# Altium schematic sheet QVAR.SchDoc: QVAR sensor
size A4; Organization: ETHZ D-ITET PBL, IIS; DocumentNumber: 3; SheetNumber: 3; SheetTotal: 3; FileInfo: QVAR.SchDoc
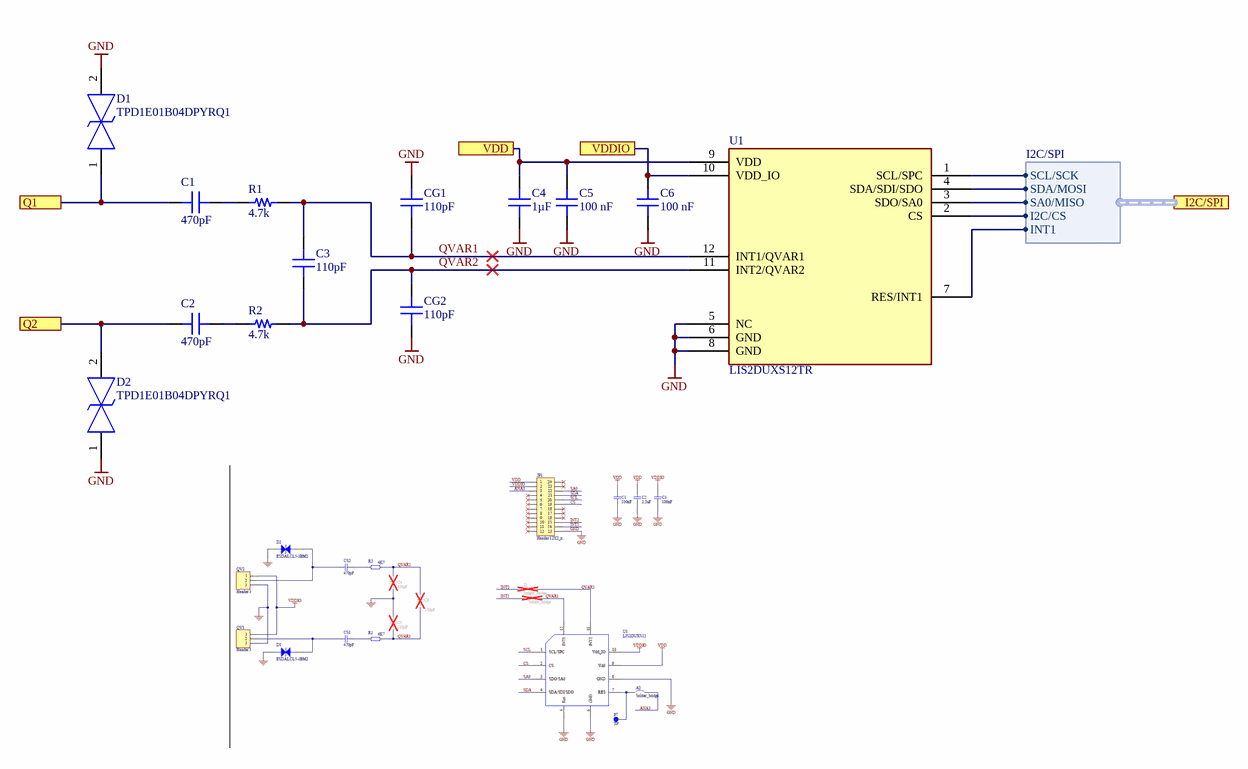
[diagram p0: QVAR.SchDoc]

## Parts
C1  470pF  [CAP_0201]
C2  470pF  [CAP_0201]
C3  110pF  [CAP_0201]
C4  1µF  [CAP_0201]
C5  100 nF  [CAP_0201]
C6  100 nF  [CAP_0201]
CG1  110pF  [CAP_0201]
CG2  110pF  [CAP_0201]
D1  TPD1E01B04DPYRQ1  [TPD1E01B04DPYRQ1]
D2  TPD1E01B04DPYRQ1  [TPD1E01B04DPYRQ1]
R1  4.7k  [RES_0201]
R2  4.7k  [RES_0201]
U1  LIS2DUXS12TR  [QFN_DUXS12_STM-M]

## Ports
I2C/SPI (harness I2C/SPI), Q1, Q2, VDD, VDDIO

## Harnesses
I2C/SPI: SCL/SCK, SDA/MOSI, SA0/MISO, I2C/CS, INT1

## Nets
GND: C4.2 C5.1 C6.1 CG1.1 CG2.1 D1.2 D2.1 U1.5(NC) U1.6(GND) U1.8(GND)
Q1: C1.1 D1.1 ; port Q1
Q2: C2.1 D2.2 ; port Q2
QVAR1: C3.1 CG1.2 R1.2 U1.12(INT1/QVAR1)
QVAR2: C3.2 CG2.2 R2.2 U1.11(INT2/QVAR2)
VDD: C4.1 C5.2 U1.9(VDD) ; port VDD
VDDIO: C6.2 U1.10(VDD_IO) ; port VDDIO
NetC1_2: C1.2 R1.1
NetC2_2: C2.2 R2.1
NetU1_1: U1.1(SCL/SPC) ; port I2C/SPI.SCL/SCK
NetU1_2: U1.2(CS) ; port I2C/SPI.I2C/CS
NetU1_3: U1.3(SDO/SA0) ; port I2C/SPI.SA0/MISO
NetU1_4: U1.4(SDA/SDI/SDO) ; port I2C/SPI.SDA/MOSI
NetU1_7: U1.7(RES/INT1) ; port I2C/SPI.INT1

## Notes on the sheet
- Project:
- Laboratory:
- Date:
- File:
- Rev:
- Variation:
- Drawn By:
- Checked By:
- Sheet:
- /

## Library data of the parts
C1 C2 = CAP_0201_470p_25V: CAP CER 470PF 25V C0G 0201; Manufacturer: Murata; Manufacturer Part Number: GRM0335C1E471JA01D; Capacitor Type: Ceramic; Multilayer: Yes; Tolerance  (fill in as +-): 5%; Supplier 1: Mouser; RoHS: Yes; Category: Ceramic Capacitors; Stock 1: 32770; Pricing 1: 1=0.1, 10=0.007, 50=0.007, 100=0.004, 1000=0.003, 10000=0.003 (USD); Mounting Technology: Surface Mount; Pins: 2; Package Shape: Rectangular; Case/Package: 0201; Terminal Finish: Tin; Min Operating Temperature: -55°C; Max Operating Temperature: 125°C; JESD-609 Code: e3; Value: 470pF; Packaging: Tape and Reel; Rated DC Voltage (URdc): 25V; Temperature Characteristics Code: C0G; Termination: Wraparound; Reach SVHC Compliant: Yes; RoHS Compliant: Yes; ComponentLink1URL: https://psearch.en.murata.com:443/capacitor/product/GRM0335C1E471JA01%23.pdf?src-supplier=IHS+Markit; ComponentLink1Description: https://psearch.en.murata.com:443/capacitor/product/GRM0335C1E471JA01%23.pdf?src-supplier=IHS+Markit; Supplier Part Number 1: 81-GRM0335C1E471JA1D; ComponentLink2Description: http://search.murata.co.jp/Ceramy/image/img/A01X/G101/ENG/GRM0335C1E471JA01-01.pdf?src-supplier=Digi-Key; ComponentLink2URL: http://search.murata.co.jp/Ceramy/image/img/A01X/G101/ENG/GRM0335C1E471JA01-01.pdf?src-supplier=Digi-Key; ComponentLink3Description: https://search.murata.co.jp/Ceramy/image/img/A01X/G101/ENG/GRM0335C1E471JA01-01.pdf?src-supplier=Digi-Key; ComponentLink3URL: https://search.murata.co.jp/Ceramy/image/img/A01X/G101/ENG/GRM0335C1E471JA01-01.pdf?src-supplier=Digi-Key; ComponentLink4Description: https://datasheet.octopart.com/GRM0335C1E471JA01D-Murata-datasheet-165579666.pdf?src-supplier=TME; ComponentLink4URL: https://datasheet.octopart.com/GRM0335C1E471JA01D-Murata-datasheet-165579666.pdf?src-supplier=TME; Dielectric Material: Ceramic; Tolerance (fill in as +-): 5%
C3 CG1 CG2 = CAP_0201_110p_50V: CAP CER 110PF 50V C0G 0201; Manufacturer: Murata; Manufacturer Part Number: GRM0335C1H111JA01D; Capacitor Type: Ceramic; Multilayer: Yes; Tolerance  (fill in as +-): 5%; Supplier 1: Mouser; Supplier Part Number 1: 81-GRM0335C1H111JA1D; Case/Package: 0201; Category: Ceramic Capacitors; ComponentLink1Description: https://psearch.en.murata.com:443/capacitor/product/GRM0335C1H111JA01%23.pdf?src-supplier=IHS+Markit; ComponentLink1URL: https://psearch.en.murata.com:443/capacitor/product/GRM0335C1H111JA01%23.pdf?src-supplier=IHS+Markit; ComponentLink2Description: https://datasheet.ciiva.com/18699/grm0335c1h111ja01-01-18699253.pdf?src-supplier=Digi-Key; ComponentLink2URL: https://datasheet.ciiva.com/18699/grm0335c1h111ja01-01-18699253.pdf?src-supplier=Digi-Key; ComponentLink3Description: https://datasheet.ciiva.com/18699/partnumbering-e-01-18699254.pdf?src-supplier=Digi-Key; ComponentLink3URL: https://datasheet.ciiva.com/18699/partnumbering-e-01-18699254.pdf?src-supplier=Digi-Key; ComponentLink4Description: https://datasheet.ciiva.com/18699/partnumbering-e-01-18699255.pdf?src-supplier=Digi-Key; ComponentLink4URL: https://datasheet.ciiva.com/18699/partnumbering-e-01-18699255.pdf?src-supplier=Digi-Key; Dielectric Material: Ceramic; Max Operating Temperature: 125°C; Min Operating Temperature: -55°C; Mounting Technology: Surface Mount; Package Shape: Rectangular; Packaging: Tape and Reel; Pins: 2; Pricing 1: 1=0.1, 10=0.006, 50=0.006, 100=0.004, 1000=0.003, 10000=0.002 (USD); Rated DC Voltage (URdc): 50V; Reach SVHC Compliant: Yes; RoHS: Yes; RoHS Compliant: Yes; Stock 1: 26582; Temperature Characteristics Code: C0G; Termination: Wraparound; Tolerance (fill in as +-): 5%; Value: 110pF
C4 = CAP_0201_1u_10V: CAP CER 1UF 10V X6S; Manufacturer: Murata; Manufacturer Part Number: GRM033C81A105ME05D; Capacitor Type: Ceramic; Multilayer: Yes; Tolerance  (fill in as +-): 20%; Supplier 1: Mouser; Supplier Part Number 1: 81-GRM033C81A105ME5D; Case/Package: 0201; Category: Ceramic Capacitors; ComponentLink1Description: https://psearch.en.murata.com:443/capacitor/product/GRM033C81A105ME05%23.pdf?src-supplier=IHS+Markit; ComponentLink1URL: https://psearch.en.murata.com:443/capacitor/product/GRM033C81A105ME05%23.pdf?src-supplier=IHS+Markit; ComponentLink2Description: http://search.murata.co.jp/Ceramy/image/img/A01X/G101/ENG/GRM033C81A105ME05-01.pdf?src-supplier=Digi-Key; ComponentLink2URL: http://search.murata.co.jp/Ceramy/image/img/A01X/G101/ENG/GRM033C81A105ME05-01.pdf?src-supplier=Digi-Key; ComponentLink3Description: https://datasheet.octopart.com/GRM033C81A105ME05D-Murata-datasheet-86813717.pdf?src-supplier=Future+Electronics; ComponentLink3URL: https://datasheet.octopart.com/GRM033C81A105ME05D-Murata-datasheet-86813717.pdf?src-supplier=Future+Electronics; ComponentLink4Description: https://datasheet.octopart.com/GRM033C81A105ME05D-Murata-datasheet-165579666.pdf?src-supplier=TME; ComponentLink4URL: https://datasheet.octopart.com/GRM033C81A105ME05D-Murata-datasheet-165579666.pdf?src-supplier=TME; Dielectric Material: Ceramic; JESD-609 Code: e3; Max Operating Temperature: 105°C; Min Operating Temperature: -55°C; Mounting Technology: Surface Mount; Package Shape: Rectangular; Packaging: Tape and Reel; Pins: 2; Pricing 1: 1=0.3, 10=0.147, 50=0.147, 100=0.095, 1000=0.079, 10000=0.066 (USD); Rated DC Voltage (URdc): 10V; Reach SVHC Compliant: Yes; RoHS: Yes; RoHS Compliant: Yes; Stock 1: 212716; Temperature Characteristics Code: X6S; Terminal Finish: Nickel; Termination: Wraparound; Tolerance (fill in as +-): 20%; Value: 1uF
C5 C6 = CAP_0201_100n_10V: CAP CER 0.1UF 25V X5R 0201; Manufacturer: Murata; Manufacturer Part Number: GRM033R6YA104ME14D; Capacitor Type: Ceramic; Multilayer: Yes; Rated DC Voltage (URdc): 35V; Tolerance  (fill in as +-): 20%; Value: 100nF; Supplier 1: Mouser; Supplier Part Number 1: 81-GRM33R6YA104ME14D; Case/Package: 0201; Category: Ceramic Capacitors; ComponentLink1Description: https://psearch.en.murata.com:443/capacitor/product/GRM033R6YA104ME14%23.pdf?src-supplier=IHS+Markit; ComponentLink1URL: https://psearch.en.murata.com:443/capacitor/product/GRM033R6YA104ME14%23.pdf?src-supplier=IHS+Markit; ComponentLink2Description: http://www.mouser.com/ds/2/281/c02e-2905.pdf?src-supplier=Mouser; ComponentLink2URL: http://www.mouser.com/ds/2/281/c02e-2905.pdf?src-supplier=Mouser; ComponentLink3Description: http://search.murata.co.jp/Ceramy/image/img/A01X/G101/ENG/GRM033R6YA104ME14-01.pdf?src-supplier=Digi-Key; ComponentLink3URL: http://search.murata.co.jp/Ceramy/image/img/A01X/G101/ENG/GRM033R6YA104ME14-01.pdf?src-supplier=Digi-Key; ComponentLink4Description: https://datasheet.octopart.com/GRM033R6YA104ME14D-Murata-datasheet-82944622.pdf?src-supplier=Future+Electronics; ComponentLink4URL: https://datasheet.octopart.com/GRM033R6YA104ME14D-Murata-datasheet-82944622.pdf?src-supplier=Future+Electronics; Dielectric Material: Ceramic; Height: 0.3mm; JESD-609 Code: e3; Length: 0.6mm; Max Operating Temperature: 85°C; Min Operating Temperature: -55°C; Mounting Technology: Surface Mount; Package Shape: Rectangular; Package Style: SMTMeter; Packaging: Tape and Reel; Pins: 2; Pricing 1: 1=0.1, 10=0.013, 50=0.013, 100=0.008, 1000=0.006, 10000=0.005 (USD); Reach SVHC Compliant: Yes; RoHS: Yes; RoHS Compliant: Yes; Stock 1: 286132; Temperature Characteristics Code: X5R; Terminal Finish: Nickel; Termination: Wraparound; Tolerance (fill in as +-): 20%; Width: 0.3mm
D1 D2 = TPD1E01B04DPYRQ1: TVS Diode (Bi-directional); Manufacturer: Texas Instruments; Manufacturer Part Number: TPD1E01B04DPYRQ1; Category: Integrated Circuits (ICs); Pricing 1: 1=0.48, 10=0.358, 50=0.358, 100=0.229, 1000=0.143, 10000=0.114 (USD); RoHS: No; Stock 1: 7769; Supplier 1: Mouser; Supplier Part Number 1: 595-TPD1E01B04DPYRQ1
R1 R2 = R_0201_4.7K: R 4.7K 1% 50mW 0201; Manufacturer: Panasonic; Manufacturer Part Number: ERJ-1GNF4701C; Rated Temperature: 70°C; Temperature Coefficient: 200ppm/°C; Working Voltage: 25V; Package Height: 0.23mm; Package Length: 0.6mm; Package Width: 0.3mm; Reference Standard: AEC-Q200; Supplier 1: Mouser; RoHS: Yes; Category: Chip SMD Resistors; Stock 1: 339994; Pricing 1: 1=0.1, 10=0.023, 50=0.023, 100=0.014, 1000=0.01, 10000=0.007 (USD); Mounting Technology: Surface Mount; Pins: 2; Package Shape: Rectangular; Case/Package: 0201; Terminal Finish: Nickel; Min Operating Temperature: -55°C; Max Operating Temperature: 125°C; Tolerance: 1%; JESD-609 Code: e3; Resistor Type: FIXED RESISTOR; Construction: Rectangular; Package Style: SMTMeter; Packaging: Tape and Reel; Power: 50mW; Value: 4.7k; Technology: METAL GLAZE/THICK FILM; Termination: Wraparound; Reach SVHC Compliant: Yes; RoHS Compliant: Yes; ComponentLink1URL: https://datasheet.ciiva.com:443/pdfs/VipMasterIC/IC/PANA/PANA-S-A0009889626/PANA-S-A0009889626-1.pdf?src-supplier=IHS+Markit; ComponentLink1Description: https://datasheet.ciiva.com:443/pdfs/VipMasterIC/IC/PANA/PANA-S-A0009889626/PANA-S-A0009889626-1.pdf?src-supplier=IHS+Markit; Supplier Part Number 1: 667-ERJ-1GNF4701C; ComponentLink2Description: https://datasheet.ciiva.com/30079/erj1gn-30079779.pdf?src-supplier=Onlinecomponents.com; ComponentLink2URL: https://datasheet.ciiva.com/30079/erj1gn-30079779.pdf?src-supplier=Onlinecomponents.com
U1 = LIS2DUXS12TR: IC IMU QVAR; Manufacturer: STMicroelectronics; Manufacturer Part Number: LIS2DUXS12TR; Category: Uncategorized; Pricing 1: 1=3.99, 10=2.53, 50=2.53, 100=2.45, 1000=1.93, 10000=1.69 (USD); RoHS: No; Stock 1: 1438; Supplier 1: Mouser; Supplier Part Number 1: 511-LIS2DUXS12TR